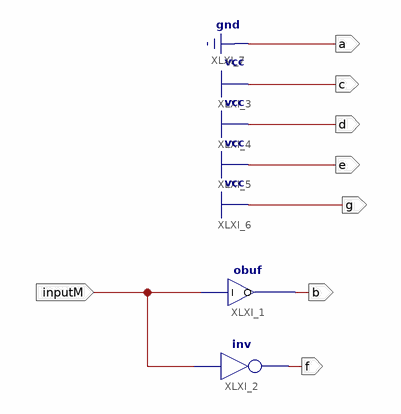
[diagram p0: schematic sheet 1]
// Xilinx ISE schematic d6.sch (spartan6) as structural Verilog: 2 symbols, 8 ports
module d6 (
  input  inputM,
  output a,
  output c,
  output d,
  output e,
  output g,
  output f,
  output b
);

  not XLXI_2 (f, inputM);
  obuf XLXI_1 (.I(inputM), .O(b));

  assign a = 1'b0;
  assign c = 1'b1;
  assign d = 1'b1;
  assign e = 1'b1;
  assign g = 1'b1;
endmodule
